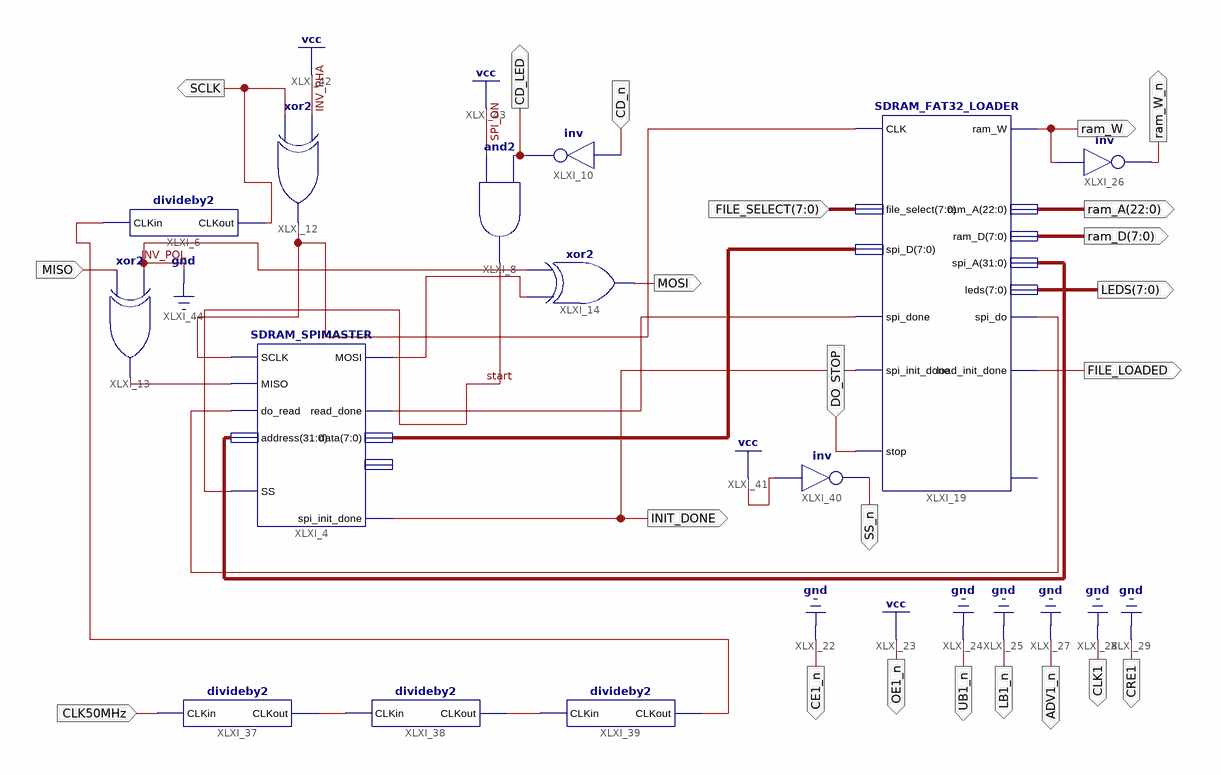
[diagram p0: schematic sheet 1]
// Xilinx ISE schematic spi_test.sch (spartan3e) as structural Verilog: 13 symbols, 23 ports
module spi_test (
  input  CD_n,
  input  MISO,
  input  [7:0] FILE_SELECT,
  input  CLK50MHz,
  input  DO_STOP,
  output CD_LED,
  output SCLK,
  output MOSI,
  output [7:0] ram_D,
  output [22:0] ram_A,
  output ram_W,
  output INIT_DONE,
  output FILE_LOADED,
  output ram_W_n,
  output CE1_n,
  output OE1_n,
  output UB1_n,
  output LB1_n,
  output ADV1_n,
  output CLK1,
  output CRE1,
  output [7:0] LEDS,
  output SS_n
);

  wire SCLK_pha, start, XLXN_45, XLXN_49, XLXN_57, XLXN_61, XLXN_70, XLXN_71, XLXN_72;
  wire [7:0] XLXN_52;
  wire [31:0] XLXN_55;

  SDRAM_SPIMASTER XLXI_4 (
    .SCLK(SCLK_pha), .MISO(XLXN_45), .SS(start), .do_read(XLXN_61), .address(XLXN_55), .MOSI(XLXN_49),
    .read_done(XLXN_57), .spi_init_done(INIT_DONE), .data(XLXN_52));  // open: leds
  divideby2 XLXI_6 (.CLKin(XLXN_70), .CLKout(SCLK));
  and XLXI_8 (start, 1'b1, CD_LED);
  not XLXI_10 (CD_LED, CD_n);
  xor XLXI_13 (XLXN_45, MISO, 1'b0);
  xor XLXI_14 (MOSI, XLXN_49, 1'b0);
  xor XLXI_12 (SCLK_pha, SCLK, 1'b1);
  SDRAM_FAT32_LOADER XLXI_19 (
    .CLK(SCLK_pha), .spi_done(XLXN_57), .spi_init_done(INIT_DONE), .stop(DO_STOP), .file_select(FILE_SELECT),
    .spi_D(XLXN_52), .ram_D(ram_D), .ram_W(ram_W), .spi_do(XLXN_61), .load_init_done(FILE_LOADED),
    .ram_A(ram_A), .spi_A(XLXN_55), .leds(LEDS));  // open: is_ucpm
  not XLXI_26 (ram_W_n, ram_W);
  divideby2 XLXI_37 (.CLKin(CLK50MHz), .CLKout(XLXN_72));
  divideby2 XLXI_38 (.CLKin(XLXN_72), .CLKout(XLXN_71));
  divideby2 XLXI_39 (.CLKin(XLXN_71), .CLKout(XLXN_70));
  not XLXI_40 (SS_n, 1'b1);

  assign ADV1_n = 1'b0;
  assign CE1_n = 1'b0;
  assign CLK1 = 1'b0;
  assign CRE1 = 1'b0;
  assign LB1_n = 1'b0;
  assign OE1_n = 1'b1;
  assign UB1_n = 1'b0;
endmodule
